# Altium schematic sheet CAN Interface.SchDoc
size A4
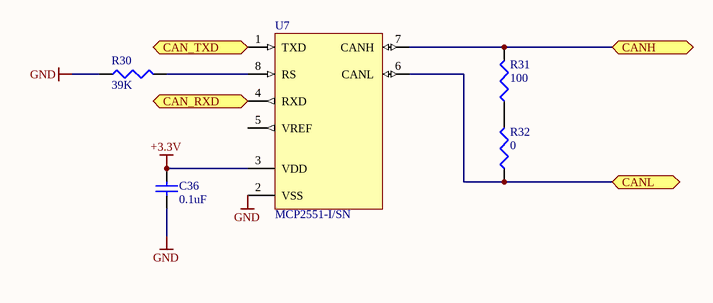
[diagram p0: CAN Interface.SchDoc]

## Parts
C36  0.1uF  [2012[0805]]
R30  39K  [R2012[0805]]
R31  100  [R2012[0805]]
R32  0  [R2012[0805]]
U7  MCP2551-I/SN  [SOIC-SN8_N]

## Ports
CAN_RXD (out), CAN_TXD (in), CANH (bidir), CANL (bidir)

## Nets
+3.3V: C36.2 U7.3(VDD)
GND: C36.1 R30.1 U7.2(VSS)
CAN_RXD: U7.4(RXD) ; port CAN_RXD
CAN_TXD: U7.1(TXD) ; port CAN_TXD
CANH: R31.2 U7.7(CANH) ; port CANH
CANL: R32.1 U7.6(CANL) ; port CANL
NetR30_2: R30.2 U7.8(RS)
NetR31_1: R31.1 R32.2

Not connected (* = marked no-connect by the designer): U7 5(VREF)

## Library data of the parts
C36 = C0805: Ceramic Chip Capacitor - Standard; Note: Footprint corresponds to dimensions for bulk cassette packaging. This case size has tightened tolerances.; Published: 17-Jul-2002; LatestRevisionDate: 19-Mar-2004; LatestRevisionNote: Silkscreen size reduced.; DatasheetDocument: Mar-2001; PackageDocument: Mar-2001; PackageReference: 0805; Publisher: Altium Limited; Code_JEITA: 0805; Code_IPC: 2012[0805]; ComponentLink1Description: Manufacturer Link; ComponentLink1URL: http://www.kemet.com/; ComponentLink2Description: Datasheet; ComponentLink2URL: http://www.kemet.com/kemet/web/homepage/kechome.nsf/vapubfilesname/F3102TA.pdf/$file/F3102TA.pdf; Value: 0.1uF
R30-R32 = R0805: Published: 8-Jun-2000; LatestRevisionDate: 29-May-2009; LatestRevisionNote: IPC-7351 Footprint Added.; PackageReference: J1-0603; Publisher: Altium Limited; PackageDescription: Chip Resistor
  R30: Value: 39K
  R31: Value: 100
  R32: Value: 0
U7 = MCP2551-I/SN: High-Speed CAN Transceiver, 8-Pin SOIC, Industrial Temperature; DatasheetVersion: revF, Jul-2010; PackageVersion: revBB, Aug-2009; PackageReference: SOIC-SN8; PackageDescription: 8-Lead Plastic Small Outline (SN) - Narrow, 3.90mm Body [SOIC]; Code_JEDEC: MS-012; Code_IPC: SOIC127P600-8; ComponentLink1Description: Manufacturer URL; ComponentLink1URL: http://www.microchip.com/; ComponentLink2Description: Datasheet; ComponentLink2URL: http://ww1.microchip.com/downloads/en/DeviceDoc/21667F.pdf; ComponentLink3Description: Package Specification; ComponentLink3URL: http://www.microchip.com/stellent/groups/techpub_sg/documents/packagingspec/en012702.pdf